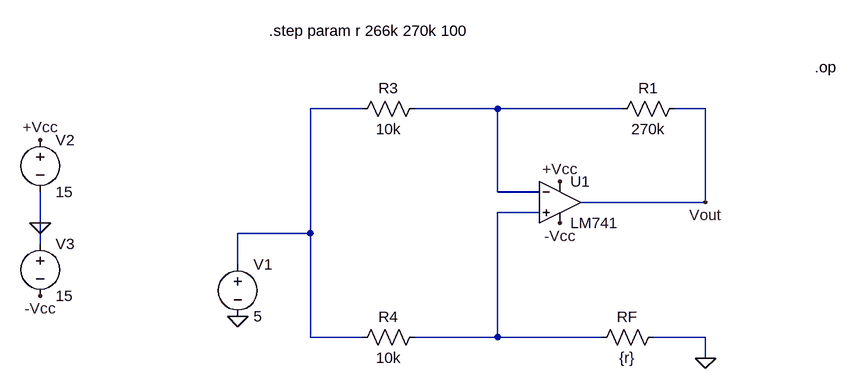
[diagram p0: schematic DCnull.asc]
DCnull.asc, the LTspice schematic file:
Version 4
SHEET 1 880 680
WIRE 0 64 -80 64
WIRE 208 64 80 64
WIRE 400 64 208 64
WIRE 528 64 480 64
WIRE 208 192 208 64
WIRE 272 192 208 192
WIRE 528 208 528 64
WIRE 528 208 336 208
WIRE 272 224 208 224
WIRE -496 240 -496 192
WIRE -80 256 -80 64
WIRE -80 256 -192 256
WIRE -496 272 -496 240
WIRE -192 304 -192 256
WIRE -80 416 -80 256
WIRE 0 416 -80 416
WIRE 208 416 208 224
WIRE 208 416 80 416
WIRE 368 416 208 416
WIRE 528 416 448 416
WIRE 528 448 528 416
FLAG -496 240 0
FLAG -192 384 0
FLAG 528 448 0
FLAG 304 176 +Vcc
FLAG 304 240 -Vcc
FLAG -496 112 +Vcc
FLAG -496 352 -Vcc
FLAG 528 208 Vout
SYMBOL Opamps\\LM741 304 144 R0
SYMATTR InstName U1
SYMATTR SpiceModel ""
SYMBOL res 496 48 R90
WINDOW 0 0 56 VBottom 2
WINDOW 3 32 56 VTop 2
SYMATTR InstName R1
SYMATTR Value 270k
SYMBOL res 464 400 R90
WINDOW 0 0 56 VBottom 2
WINDOW 3 32 56 VTop 2
SYMATTR InstName RF
SYMATTR Value {r}
SYMBOL res 96 48 R90
WINDOW 0 0 56 VBottom 2
WINDOW 3 32 56 VTop 2
SYMATTR InstName R3
SYMATTR Value 10k
SYMBOL res 96 400 R90
WINDOW 0 0 56 VBottom 2
WINDOW 3 32 56 VTop 2
SYMATTR InstName R4
SYMATTR Value 10k
SYMBOL voltage -192 288 R0
SYMATTR InstName V1
SYMATTR Value 5
SYMBOL voltage -496 96 R0
SYMATTR InstName V2
SYMATTR Value 15
SYMBOL voltage -496 256 R0
SYMATTR InstName V3
SYMATTR Value 15
TEXT 696 0 Left 2 !.op
TEXT -144 -56 Left 2 !.step param r 266k 270k 100

The netlist it stands for:
* DCnull.asc
XU1 N003 N002 +Vcc -Vcc Vout LM741  ; pins In+ In- V+ V- OUT
R1 Vout N002 270k
RF 0 N003 {r}
R3 N002 N001 10k
R4 N003 N001 10k
V1 N001 0 5
V2 +Vcc 0 15
V3 0 -Vcc 15
.op
.step param r 266k 270k 100
.lib LM741.lib
.backanno
.end